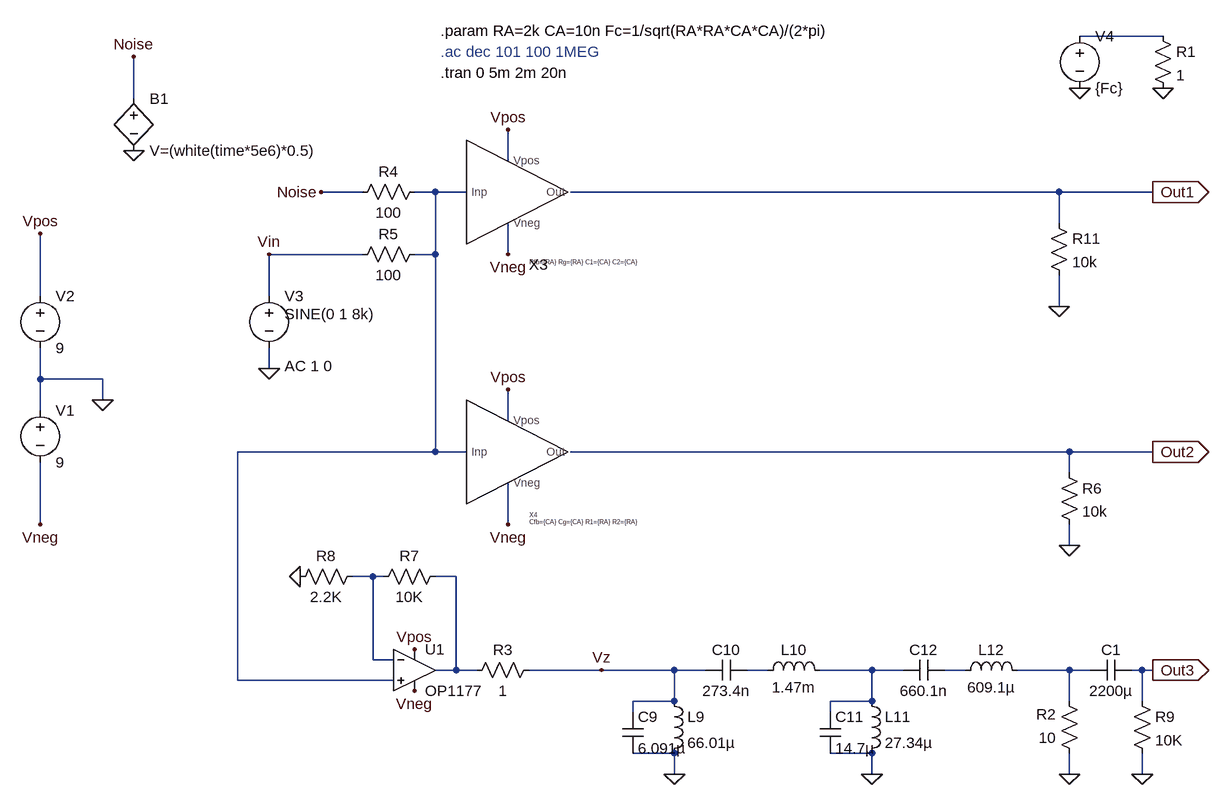
[diagram p0: schematic sallen_key.asc]
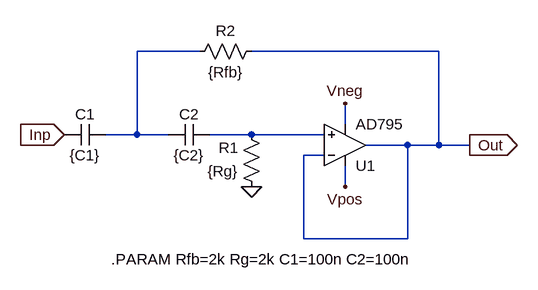
[diagram p1: sub-circuit sallen_key_high_pass.asc]
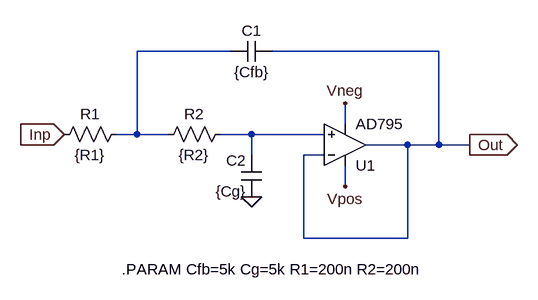
[diagram p2: sub-circuit sallen_key_low_pass.asc]
sallen_key.asc, the LTspice schematic file:
Version 4
SHEET 1 1768 964
WIRE 848 -208 720 -208
WIRE -736 -112 -736 -176
WIRE -160 -16 -160 -64
WIRE -384 32 -448 32
WIRE -272 32 -304 32
WIRE -224 32 -272 32
WIRE 688 32 -64 32
WIRE 832 32 688 32
WIRE 688 80 688 32
WIRE -384 128 -528 128
WIRE -272 128 -272 32
WIRE -272 128 -304 128
WIRE -160 128 -160 80
WIRE -880 192 -880 96
WIRE -528 192 -528 128
WIRE 688 208 688 160
WIRE -528 304 -528 272
WIRE -880 320 -880 272
WIRE -784 320 -880 320
WIRE -784 352 -784 320
WIRE -880 368 -880 320
WIRE -160 384 -160 336
WIRE -272 432 -272 128
WIRE -272 432 -576 432
WIRE -224 432 -272 432
WIRE 704 432 -64 432
WIRE 832 432 704 432
WIRE 704 464 704 432
WIRE -880 544 -880 448
WIRE -160 544 -160 480
WIRE 704 576 704 544
WIRE -368 624 -400 624
WIRE -352 624 -368 624
WIRE -240 624 -272 624
WIRE -368 752 -368 624
WIRE -336 752 -368 752
WIRE -240 768 -240 624
WIRE -240 768 -272 768
WIRE -208 768 -240 768
WIRE -16 768 -128 768
WIRE 96 768 -16 768
WIRE 144 768 96 768
WIRE 240 768 208 768
WIRE 400 768 320 768
WIRE 448 768 400 768
WIRE 544 768 512 768
WIRE 704 768 624 768
WIRE 736 768 704 768
WIRE 816 768 800 768
WIRE 832 768 816 768
WIRE -576 784 -576 432
WIRE -336 784 -576 784
WIRE 96 816 96 768
WIRE 96 816 32 816
WIRE 400 816 400 768
WIRE 400 816 336 816
WIRE 704 816 704 768
WIRE 816 816 816 768
WIRE 32 832 32 816
WIRE 336 832 336 816
WIRE 96 896 32 896
WIRE 400 896 336 896
WIRE 96 928 96 896
WIRE 400 928 400 896
WIRE 704 928 704 896
WIRE 816 928 816 896
FLAG -784 352 0
FLAG -880 96 Vpos
FLAG -880 544 Vneg
FLAG -528 304 0
FLAG 832 32 Out1
IOPIN 832 32 Out
FLAG 832 432 Out2
IOPIN 832 432 Out
FLAG 704 576 0
FLAG 688 208 0
FLAG -160 -64 Vpos
FLAG -160 128 Vneg
FLAG -160 336 Vpos
FLAG -160 544 Vneg
FLAG 720 -128 0
FLAG 848 -128 0
FLAG 96 928 0
FLAG 400 928 0
FLAG 832 768 Out3
IOPIN 832 768 Out
FLAG -528 128 Vin
FLAG 704 928 0
FLAG -16 768 Vz
FLAG -736 -32 0
FLAG -736 -176 Noise
FLAG -448 32 Noise
FLAG -304 800 Vneg
FLAG -304 736 Vpos
FLAG -480 624 0
FLAG 816 928 0
DATAFLAG 784 -208 ""
SYMBOL voltage -880 352 R0
WINDOW 123 0 0 Left 0
WINDOW 39 0 0 Left 0
SYMATTR InstName V1
SYMATTR Value 9
SYMBOL voltage -880 176 R0
WINDOW 123 0 0 Left 0
WINDOW 39 0 0 Left 0
SYMATTR InstName V2
SYMATTR Value 9
SYMBOL voltage -528 176 R0
WINDOW 123 24 124 Left 2
WINDOW 39 24 44 Left 2
WINDOW 3 24 44 Left 2
SYMATTR Value2 AC 1 0
SYMATTR Value SINE(0 1 8k)
SYMATTR InstName V3
SYMBOL res 688 448 R0
SYMATTR InstName R6
SYMATTR Value 10k
SYMBOL res 672 64 R0
SYMATTR InstName R11
SYMATTR Value 10k
SYMBOL sallen_key_high_pass -144 32 R0
WINDOW 39 17 108 Left 0
SYMATTR SpiceLine Rfb={RA} Rg={RA} C1={CA} C2={CA}
SYMATTR InstName X3
SYMATTR Prefix ""
SYMATTR Value ""
SYMBOL sallen_key_low_pass -144 432 R0
WINDOW 39 17 108 Left 0
SYMATTR SpiceLine Cfb={CA} Cg={CA} R1={RA} R2={RA}
SYMATTR InstName X4
SYMBOL res 832 -224 R0
SYMATTR InstName R1
SYMATTR Value 1
SYMBOL voltage 720 -224 R0
WINDOW 123 0 0 Left 0
WINDOW 39 0 0 Left 0
SYMATTR InstName V4
SYMATTR Value {Fc}
SYMBOL ind 80 800 R0
SYMATTR InstName L9
SYMATTR Value 66.01µ
SYMBOL cap 16 832 R0
SYMATTR InstName C9
SYMATTR Value 6.091µ
SYMBOL cap 208 752 R90
WINDOW 0 0 32 VBottom 2
WINDOW 3 32 32 VTop 2
SYMATTR InstName C10
SYMATTR Value 273.4n
SYMBOL ind 224 784 R270
WINDOW 0 32 56 VTop 2
WINDOW 3 5 56 VBottom 2
SYMATTR InstName L10
SYMATTR Value 1.47m
SYMBOL ind 384 800 R0
SYMATTR InstName L11
SYMATTR Value 27.34µ
SYMBOL cap 320 832 R0
SYMATTR InstName C11
SYMATTR Value 14.7µ
SYMBOL cap 512 752 R90
WINDOW 0 0 32 VBottom 2
WINDOW 3 32 32 VTop 2
SYMATTR InstName C12
SYMATTR Value 660.1n
SYMBOL ind 528 784 R270
WINDOW 0 32 56 VTop 2
WINDOW 3 5 56 VBottom 2
SYMATTR InstName L12
SYMATTR Value 609.1µ
SYMBOL res 720 912 R180
WINDOW 0 36 76 Left 2
WINDOW 3 36 40 Left 2
SYMATTR InstName R2
SYMATTR Value 10
SYMBOL res -112 752 R90
WINDOW 0 0 56 VBottom 2
WINDOW 3 32 56 VTop 2
SYMATTR InstName R3
SYMATTR Value 1
SYMBOL bv -736 -128 R0
SYMATTR InstName B1
SYMATTR Value V=(white(time*5e6)*0.5)
SYMBOL res -288 16 R90
WINDOW 0 0 56 VBottom 2
WINDOW 3 32 56 VTop 2
SYMATTR InstName R4
SYMATTR Value 100
SYMBOL res -288 112 R90
WINDOW 0 0 56 VBottom 2
WINDOW 3 32 56 VTop 2
SYMATTR InstName R5
SYMATTR Value 100
SYMBOL cap 800 752 R90
WINDOW 0 0 32 VBottom 2
WINDOW 3 32 32 VTop 2
SYMATTR InstName C1
SYMATTR Value 2200µ
SYMBOL OpAmps\\OP1177 -304 704 R0
SYMATTR InstName U1
SYMBOL res -256 608 R90
WINDOW 0 0 56 VBottom 2
WINDOW 3 32 56 VTop 2
SYMATTR InstName R7
SYMATTR Value 10K
SYMBOL res -384 608 R90
WINDOW 0 0 56 VBottom 2
WINDOW 3 32 56 VTop 2
SYMATTR InstName R8
SYMATTR Value 2.2K
SYMBOL res 800 800 R0
SYMATTR InstName R9
SYMATTR Value 10K
TEXT -264 -216 Left 2 !.param RA=2k CA=10n Fc=1/sqrt(RA*RA*CA*CA)/(2*pi)
TEXT -264 -184 Left 2 ;.ac dec 101 100 1MEG
TEXT -264 -152 Left 2 !.tran 0 5m 2m 20n

sallen_key_high_pass.asc, the sub-circuit schematic file:
Version 4
SHEET 1 880 680
WIRE 96 224 0 224
WIRE 464 224 176 224
WIRE 320 336 320 304
WIRE 0 352 0 224
WIRE 0 352 -48 352
WIRE 48 352 0 352
WIRE 176 352 112 352
WIRE 288 352 176 352
WIRE 416 368 352 368
WIRE 464 368 464 224
WIRE 464 368 416 368
WIRE 512 368 464 368
WIRE 288 384 256 384
WIRE 320 432 320 400
WIRE 256 512 256 384
WIRE 416 512 416 368
WIRE 416 512 256 512
FLAG 176 432 0
FLAG 320 304 Vneg
FLAG 320 432 Vpos
FLAG -112 352 Inp
IOPIN -112 352 In
FLAG 512 368 Out
IOPIN 512 368 Out
SYMBOL OpAmps\\AD795 320 432 M180
SYMATTR InstName U1
SYMBOL res 192 448 R180
WINDOW 0 36 76 Left 2
WINDOW 3 36 40 Left 2
SYMATTR InstName R1
SYMATTR Value {Rg}
SYMBOL res 80 240 R270
WINDOW 0 32 56 VTop 2
WINDOW 3 0 56 VBottom 2
SYMATTR InstName R2
SYMATTR Value {Rfb}
SYMBOL cap -48 336 R90
WINDOW 0 0 32 VBottom 2
WINDOW 3 32 32 VTop 2
SYMATTR InstName C1
SYMATTR Value {C1}
SYMBOL cap 112 336 R90
WINDOW 0 0 32 VBottom 2
WINDOW 3 32 32 VTop 2
SYMATTR InstName C2
SYMATTR Value {C2}
TEXT -40 544 Left 2 !.PARAM Rfb=2k Rg=2k C1=100n C2=100n

sallen_key_low_pass.asc, the sub-circuit schematic file:
Version 4
SHEET 1 880 680
WIRE 96 -64 -48 -64
WIRE 416 -64 160 -64
WIRE 272 48 272 16
WIRE -48 64 -48 -64
WIRE -48 64 -80 64
WIRE 0 64 -48 64
WIRE 128 64 80 64
WIRE 240 64 128 64
WIRE 368 80 304 80
WIRE 416 80 416 -64
WIRE 416 80 368 80
WIRE 464 80 416 80
WIRE 128 96 128 64
WIRE 240 96 208 96
WIRE 272 144 272 112
WIRE 208 224 208 96
WIRE 368 224 368 80
WIRE 368 224 208 224
FLAG 128 160 0
FLAG 272 16 Vneg
FLAG 272 144 Vpos
FLAG -160 64 Inp
IOPIN -160 64 In
FLAG 464 80 Out
IOPIN 464 80 Out
SYMBOL OpAmps\\AD795 272 144 M180
SYMATTR InstName U1
SYMBOL res -16 80 R270
WINDOW 0 32 56 VTop 2
WINDOW 3 0 56 VBottom 2
SYMATTR InstName R2
SYMATTR Value {R2}
SYMBOL res -176 80 R270
WINDOW 0 32 56 VTop 2
WINDOW 3 0 56 VBottom 2
SYMATTR InstName R1
SYMATTR Value {R1}
SYMBOL cap 160 -80 R90
WINDOW 0 0 32 VBottom 2
WINDOW 3 32 32 VTop 2
SYMATTR InstName C1
SYMATTR Value {Cfb}
SYMBOL cap 144 160 R180
WINDOW 0 24 56 Left 2
WINDOW 3 24 8 Left 2
SYMATTR InstName C2
SYMATTR Value {Cg}
TEXT -72 272 Left 2 !.PARAM Cfb=5k Cg=5k R1=200n R2=200n

The netlist it stands for:
* sallen_key.asc
V1 0 Vneg 9
V2 Vpos 0 9
V3 Vin 0 SINE(0 1 8k) AC 1 0
R6 Out2 0 10k
R11 Out1 0 10k
XX3 N002 Out1 Vpos Vneg sallen_key_high_pass params: Rfb={RA} Rg={RA} C1={CA} C2={CA}
XX4 N002 Out2 Vpos Vneg sallen_key_low_pass params: Cfb={CA} Cg={CA} R1={RA} R2={RA}
R1 N001 0 1
V4 N001 0 {Fc}
L9 Vz 0 66.01µ
C9 Vz 0 6.091µ
C10 N005 Vz 273.4n
L10 N005 N006 1.47m
L11 N006 0 27.34µ
C11 N006 0 14.7µ
C12 N007 N006 660.1n
L12 N007 N008 609.1µ
R2 0 N008 10
R3 Vz N004 1
B1 Noise 0 V=(white(time*5e6)*0.5)
R4 N002 Noise 100
R5 N002 Vin 100
C1 Out3 N008 2200µ
XU1 N002 N003 Vpos Vneg N004 OP1177  ; pins In+ In- V+ V- OUT
R7 N004 N003 10K
R8 N003 0 2.2K
R9 Out3 0 10K

* block symbol definitions
.subckt sallen_key_high_pass Inp Out Vpos Vneg
XU1 N002 Out Vpos Vneg Out AD795  ; pins In+ In- V+ V- OUT
R1 0 N002 {Rg}
R2 N001 Out {Rfb}
C1 N001 Inp {C1}
C2 N002 N001 {C2}
.PARAM Rfb=2k Rg=2k C1=100n C2=100n
.ends sallen_key_high_pass

.subckt sallen_key_low_pass Inp Out Vpos Vneg
XU1 N002 Out Vpos Vneg Out AD795  ; pins In+ In- V+ V- OUT
R2 N001 N002 {R2}
R1 Inp N001 {R1}
C1 Out N001 {Cfb}
C2 0 N002 {Cg}
.PARAM Cfb=5k Cg=5k R1=200n R2=200n
.ends sallen_key_low_pass

.param RA=2k CA=10n Fc=1/sqrt(RA*RA*CA*CA)/(2*pi)
* .ac dec 101 100 1MEG
.tran 0 5m 2m 20n
.lib ADI1.lib
.backanno
.end